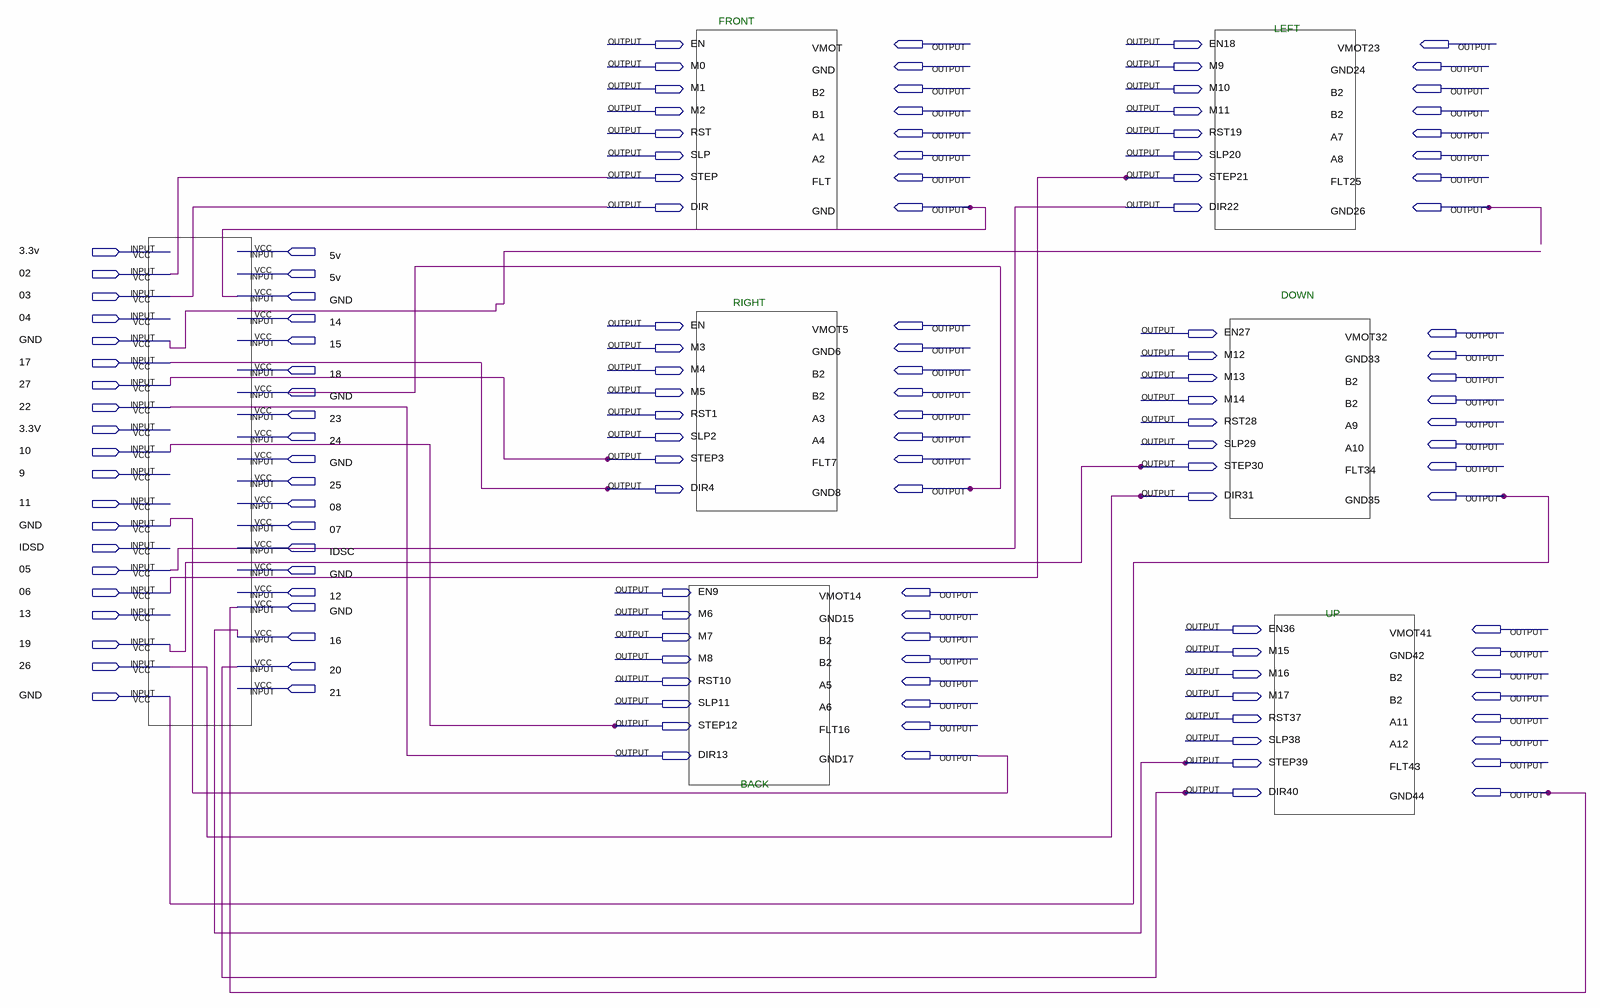
[diagram p0: schematic sheet]
// Quartus schematic wiring diagram.bdf as structural Verilog: 0 symbols, 136 pins
module \wiring_diagram  (
  input  \3.3v ,
  input  \5v ,
  input  \02 ,
  input  \03 ,
  inout  GND,
  input  \04 ,
  input  \14 ,
  input  \15 ,
  input  \17 ,
  input  \18 ,
  input  \27 ,
  input  \22 ,
  input  \23 ,
  input  \24 ,
  input  \10 ,
  input  \9 ,
  input  \25 ,
  input  \11 ,
  input  \08 ,
  input  \07 ,
  input  IDSD,
  input  IDSC,
  input  \05 ,
  input  \06 ,
  input  \12 ,
  input  \13 ,
  input  \16 ,
  input  \19 ,
  input  \26 ,
  input  \20 ,
  input  \21 ,
  output EN,
  output VMOT,
  output EN18,
  output VMOT23,
  output M0,
  output M9,
  output GND24,
  output M1,
  output B2,
  output M10,
  output M2,
  output B1,
  output M11,
  output RST,
  output A1,
  output RST19,
  output A7,
  output SLP,
  output A2,
  output SLP20,
  output A8,
  output STEP,
  output FLT,
  output STEP21,
  output FLT25,
  output DIR,
  output DIR22,
  output GND26,
  output VMOT5,
  output EN27,
  output VMOT32,
  output M3,
  output GND6,
  output M12,
  output GND33,
  output M4,
  output M13,
  output M5,
  output M14,
  output RST1,
  output A3,
  output RST28,
  output A9,
  output SLP2,
  output A4,
  output SLP29,
  output A10,
  output STEP3,
  output FLT7,
  output STEP30,
  output FLT34,
  output DIR4,
  output GND8,
  output DIR31,
  output GND35,
  output EN9,
  output VMOT14,
  output M6,
  output GND15,
  output EN36,
  output VMOT41,
  output M7,
  output M15,
  output GND42,
  output M8,
  output M16,
  output RST10,
  output A5,
  output M17,
  output SLP11,
  output A6,
  output RST37,
  output A11,
  output STEP12,
  output FLT16,
  output SLP38,
  output A12,
  output DIR13,
  output GND17,
  output STEP39,
  output FLT43,
  output DIR40,
  output GND44
);


  assign DIR = \03 ;
  assign DIR4 = \17 ;
  assign DIR13 = \22 ;
  assign DIR22 = \05 ;
  assign DIR31 = \26 ;
  assign DIR40 = \20 ;
  assign GND8 = GND;
  assign GND17 = GND;
  assign GND35 = GND;
  assign GND44 = GND;
  assign IDSC = \05 ;
  assign STEP = \02 ;
  assign STEP3 = \27 ;
  assign STEP12 = \10 ;
  assign STEP21 = \06 ;
  assign STEP30 = \19 ;
  assign STEP39 = \16 ;

  // Notes on the sheet:
  //   FRONT
  //   LEFT
  //   DOWN
  //   RIGHT
  //   UP
  //   BACK
endmodule
